# Altium schematic sheet 403.5MHz_LNA.SchDoc
size A4
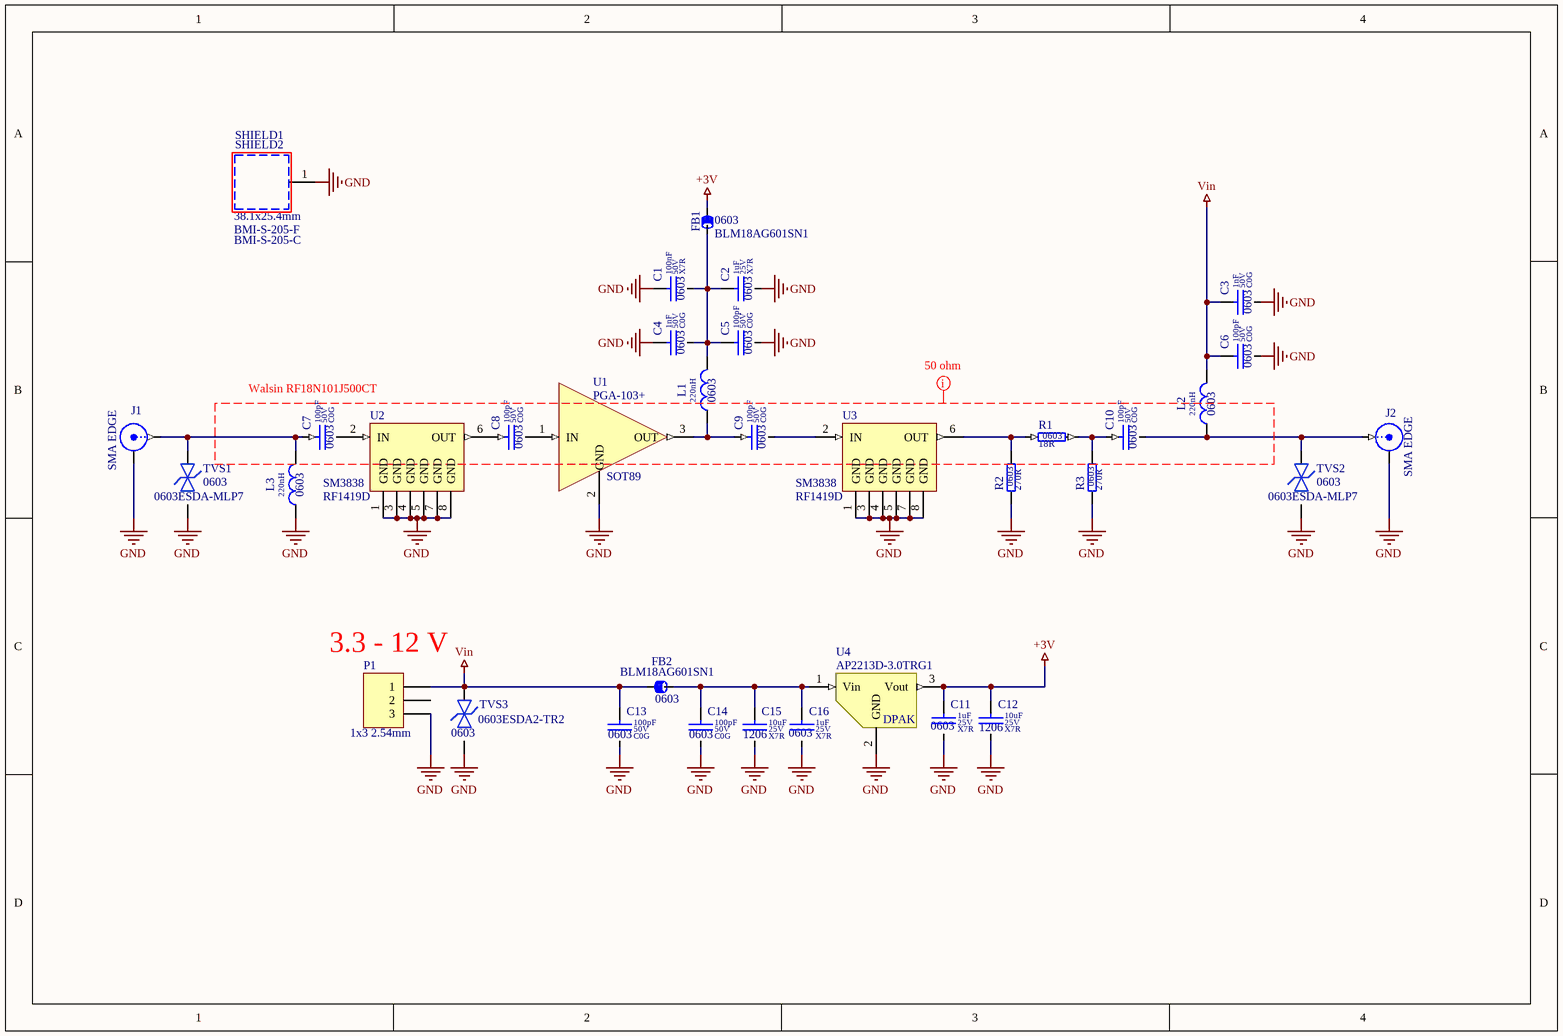
[diagram p0: 403.5MHz_LNA.SchDoc]

## Parts
C1  value 100nF  Dielectric: X7R  Voltage: 50V  SCH_Footprint: 0603  [C_0603_1608]  (hidden comment: Ceramic X7R)
C2  value 1uF  Dielectric: X7R  Voltage: 25V  SCH_Footprint: 0603  [C_0603_1608]  (hidden comment: Ceramic X7R)
C3  value 1nF  Dielectric: C0G  Voltage: 50V  SCH_Footprint: 0603  [C_0603_1608]  (hidden comment: Ceramic C0G)
C4  value 1nF  Dielectric: C0G  Voltage: 50V  SCH_Footprint: 0603  [C_0603_1608]  (hidden comment: Ceramic C0G)
C5  value 100pF  Dielectric: C0G  Voltage: 50V  SCH_Footprint: 0603  [C_0603_1608]  (hidden comment: Ceramic C0G)
C6  value 100pF  Dielectric: C0G  Voltage: 50V  SCH_Footprint: 0603  [C_0603_1608]  (hidden comment: Ceramic C0G)
C7  value 100pF  Dielectric: C0G  Voltage: 50V  SCH_Footprint: 0603  [C_0603_1608]  (hidden comment: Ceramic C0G)
C8  value 100pF  Dielectric: C0G  Voltage: 50V  SCH_Footprint: 0603  [C_0603_1608]  (hidden comment: Ceramic C0G)
C9  value 100pF  Dielectric: C0G  Voltage: 50V  SCH_Footprint: 0603  [C_0603_1608]  (hidden comment: Ceramic C0G)
C10  value 100pF  Dielectric: C0G  Voltage: 50V  SCH_Footprint: 0603  [C_0603_1608]  (hidden comment: Ceramic C0G)
C11  value 1uF  Dielectric: X7R  Voltage: 25V  SCH_Footprint: 0603  [C_0603_1608]  (hidden comment: Ceramic X7R)
C12  value 10uF  Dielectric: X7R  Voltage: 25V  SCH_Footprint: 1206  [C_1206_3216]  (hidden comment: Ceramic X7R)
C13  value 100pF  Dielectric: C0G  Voltage: 50V  SCH_Footprint: 0603  [C_0603_1608]  (hidden comment: Ceramic C0G)
C14  value 100pF  Dielectric: C0G  Voltage: 50V  SCH_Footprint: 0603  [C_0603_1608]  (hidden comment: Ceramic C0G)
C15  value 10uF  Dielectric: X7R  Voltage: 25V  SCH_Footprint: 1206  [C_1206_3216]  (hidden comment: Ceramic X7R)
C16  value 1uF  Dielectric: X7R  Voltage: 25V  SCH_Footprint: 0603  [C_0603_1608]  (hidden comment: Ceramic X7R)
FB1  value BLM18AG601SN1  SCH_Footprint: 0603  [FB_0603_1608]  (hidden comment: Ferrite bead)
FB2  value BLM18AG601SN1  SCH_Footprint: 0603  [FB_0603_1608]  (hidden comment: Ferrite bead)
J1  SMA EDGE  [J_SMA_EDGE_6.25]
J2  SMA EDGE  [J_SMA_EDGE_6.25]
L1  value 220nH  SCH_Footprint: 0603  [L_0603_1608]  (hidden comment: Inductor)
L2  value 220nH  SCH_Footprint: 0603  [L_0603_1608]  (hidden comment: Inductor)
L3  value 220nH  SCH_Footprint: 0603  [L_0603_1608]  (hidden comment: Inductor)
P1  SCH_Footprint: 1x3 2.54mm  [P_HEADER_1x3_2.54]  (hidden comment: Goldpin)
R1  value 18R  SCH_Footprint: 0603  [R_NC_0603_1608]  (hidden comment: Resistor)
R2  value 270R  SCH_Footprint: 0603  [R_NC_0603_1608]  (hidden comment: Resistor)
R3  value 270R  SCH_Footprint: 0603  [R_NC_0603_1608]  (hidden comment: Resistor)
SHIELD1  value BMI-S-205-C  [BMI-S-205-C]  (hidden comment: EMI Shield Cover)
SHIELD2  value BMI-S-205-F  SCH_Footprint: 38.1x25.4mm  [BMI-S-205-F]  (hidden comment: EMI Shield)
TVS1  value 0603ESDA-MLP7  SCH_Footprint: 0603  [R_0603_1608]  (hidden comment: TVS bidirectional)
TVS2  value 0603ESDA-MLP7  SCH_Footprint: 0603  [R_0603_1608]  (hidden comment: TVS bidirectional)
TVS3  value 0603ESDA2-TR2  SCH_Footprint: 0603  [R_0603_1608]  (hidden comment: 0603ESDA2)
U1  value PGA-103+  SCH_Footprint: SOT89  [SOT89_TO-243AA_N]  (hidden comment: PGA103+)
U2  SCH_Footprint: SM3838  [SAW_QCC8B_SM3838-8_3.8x3.8]  (hidden comment: RF1419D)
U3  SCH_Footprint: SM3838  [SAW_QCC8B_SM3838-8_3.8x3.8]  (hidden comment: RF1419D)
U4  value AP2213D-3.0TRG1  SCH_Footprint: DPAK  [DPAK_TO252-3_SC63_M]  (hidden comment: AP2213D-3.0)

## Nets
+3V: C11.1 C12.1 FB1.1 U4.3(Vout)
GND: C1.1 C2.2 C3.2 C4.1 C5.2 C6.2 C11.2 C12.2 C13.2 C14.2 C15.2 C16.2 J1.2(Y) J2.2(Y) L3.1 P1.3 R2.1 R3.1 SHIELD2.1(shield) TVS1.2 TVS2.2 TVS3.2 U1.2(GND) U2.1(GND) U2.3(GND) U2.4(GND) U2.5(GND) U2.7(GND) U2.8(GND) U3.1(GND) U3.3(GND) U3.4(GND) U3.5(GND) U3.7(GND) U3.8(GND) U4.2(GND)
Vin: C3.1 C6.1 C13.1 FB2.1 L2.2 P1.1 TVS3.1
NetC1_2: C1.2 C2.1 C4.2 C5.1 FB1.2 L1.2
NetC7_1: C7.1 J1.1(X) L3.2 TVS1.1
NetC7_2: C7.2 U2.2(IN)
NetC8_1: C8.1 U2.6(OUT)
NetC8_2: C8.2 U1.1(IN)
NetC9_1: C9.1 L1.1 U1.3(OUT)
NetC9_2: C9.2 U3.2(IN)
NetC10_1: C10.1 R1.2 R3.2
NetC10_2: C10.2 J2.1(X) L2.1 TVS2.1
NetC14_1: C14.1 C15.1 C16.1 FB2.2 U4.1(Vin)
NetR1_1: R1.1 R2.2 U3.6(OUT)

Not connected (* = marked no-connect by the designer): P1 2

## Layout directives
net class 50 ohm: (no net found under the mark)

## Notes on the sheet
- Walsin RF18N101J500CT
- 3.3 - 12 V

## Library data of the parts
C1 = C_100nF_50V_X7R_0603_5: Capacitor; Manufacturer: Samsung; Manufacturer Part Number: CL10B104JB8NNNC; Tolerance (%): 5; Part Number: C_100nF_50V_X7R_0603_5; HelpURL: http://www.tme.eu/pl/Document/4a42202b32dab16128fe107dd69598cc/samsung-chip-cap.pdf; Supplier 1: TME; Supplier Part Number 1: CL10B104JB8NNNC; Supplier 2: RS Components; Supplier 3: Farnell; Supplier 4: Mouser; Supplier 5: Digi-Key
C2 C11 C16 = C_1uF_25V_X7R_0603_10: Capacitor; Manufacturer: Samsung; Manufacturer Part Number: CL10B105KA8NNNC; Tolerance (%): 10; Part Number: C_1uF_25V_X7R_0603_10; HelpURL: http://www.tme.eu/pl/Document/4a42202b32dab16128fe107dd69598cc/samsung-chip-cap.pdf; Supplier 1: TME; Supplier Part Number 1: CL10B105KA8NNNC; Supplier 2: RS Components; Supplier 3: Farnell; Supplier 4: Mouser; Supplier 5: Digi-Key
C3 C4 = C_1nF_50V_C0G_0603_5: Capacitor; Manufacturer: Samsung; Manufacturer Part Number: CL10C102JB8NNNC; Tolerance (%): 5; Part Number: C_1nF_50V_C0G_0603_5; HelpURL: http://www.tme.eu/pl/Document/7da762c1dbaf553c64ad9c40d3603826/mlcc_samsung.pdf; Supplier 1: TME; Supplier Part Number 1: CL10C102JB8NNNC; Supplier 2: RS Components; Supplier 3: Farnell; Supplier 4: Mouser; Supplier 5: Digi-Key
C5-C10 C13 C14 = C_100pF_50V_C0G_0603_5: Capacitor; Manufacturer: Walsin; Manufacturer Part Number: RF18N101J500CT; Tolerance (%): 5; Part Number: C_100pF_50V_C0G_0603_5; HelpURL: https://pl.mouser.com/datasheet/2/210/Microwave_Caps-1535561.pdf; Supplier 1: TME; Supplier 2: RS Components; Supplier 3: Farnell; Supplier 4: Mouser; Supplier 5: Digi-Key
C12 C15 = C_10uF_25V_X7R_1206_10: Capacitor; Manufacturer: Samsung Electro-Mechanics; Manufacturer Part Number: CL31B106KAHNNNE; Tolerance (%): 10; Part Number: C_10uF_25V_X7R_1206_10; HelpURL: http://www.tme.eu/pl/Document/4a42202b32dab16128fe107dd69598cc/samsung-chip-cap.pdf; Supplier 1: TME; Supplier Part Number 1: CL31B106KAHNNNE; Supplier 2: RS Components; Supplier 3: Farnell; Supplier 4: Mouser; Supplier 5: Digi-Key
FB1 FB2 = FB_BLM18AG601SN1: Manufacturer: Murata; Manufacturer Part Number: BLM18AG601SN1D; Current: 0A5; Resistance: 600R; Part Number: FB_BLM18AG601SN1; HelpURL: http://datasheet.octopart.com/BLM18AG601SN1D-Murata-datasheet-11743096.pdf; Supplier 1: TME; Supplier 2: RS Components; Supplier Part Number 2: 7241299P; Supplier 3: Farnell; Supplier Part Number 3: 1515679; Supplier 4: Mouser; Supplier Part Number 4: 81-BLM11A601S; Supplier 5: Digi-Key; Supplier Part Number 5: 490-1014-1-ND
J1 J2 = J_SMA_EDGE_6.25: SMA connector; Manufacturer: Adam Tech; Value: RF2-143-T-17-50-G; Part Number: J_SMA_EDGE_6.25; SCH_Footprint: SMA EDGE; Component Type: Standard; HelpURL: http://www.tme.eu/pl/Document/5895dbb620da9c3499391e7670c4adea/RF2-143-T-17-50-G.pdf; Manufacturer Part Number: RF2-143-T-17-50-G; Supplier 1: TME; Supplier Part Number 1: RF2-143-T-17-50-G; Supplier 2: RS Components; Supplier 3: Farnell; Supplier 4: Mouser; Supplier 5: Digi-Key
L1-L3 = L_220nH_120mA_0603: Induction; Manufacturer: Murata; Manufacturer Part Number: LQW18ANR22G00D; Current: 120mA; Resistance: 2.5R; Part Number: L_220nH_120mA_0603; HelpURL: https://datasheet.octopart.com/LQW18ANR22G00D-Murata-datasheet-11553032.pdf; Supplier 1: TME; Supplier Part Number 1: LQW18ANR22G00D; Supplier 2: RS Components; Supplier Part Number 2: 7242872; Supplier 3: Farnell; Supplier Part Number 3: 9528059; Supplier 4: Mouser; Supplier Part Number 4: 81-LQW18ANR22G00D; Supplier 5: Digi-Key; Supplier Part Number 5: 490-6931-1-ND
P1 = P_HEADER_1x3_2.54: Header, 3-Pin; Manufacturer: Connfly; Value: DS1021-1*3SF1-1; Part Number: P_HEADER_1x3_2.54; Component Type: Standard; HelpURL: http://www.tme.eu/en/Document/cc301e58a5da78cb543a94b5a5b7f06a/DS1021.pdf; Manufacturer Part Number: DS1021-1*3SF1-1; Supplier 1: TME; Supplier Part Number 1: ZL201-03G; Supplier 2: RS Components; Supplier 3: Farnell; Supplier 4: Mouser; Supplier 5: Digi-Key
R1-R3 = R_GENERIC_0603: Part Number: R_GENERIC_0603; Supplier 1: TME; Supplier 2: RS Components; Supplier 3: Farnell; Supplier 4: Mouser; Supplier 5: Digi-Key
SHIELD1 = SHIELD_BMI-S-205-C: Shield, 1 pad; Manufacturer: Laird; SCH_Footprint: 38.1x25.4mm; Part Number: SHIELD_BMI-S-205-C; HelpURL: https://assets.lairdtech.com/home/brandworld/files/Board%20Level%20Shields%20Catalog%20Download.pdf; Manufacturer Part Number: BMI-S-205-C; Supplier 1: TME; Supplier 2: RS Components; Supplier 3: Farnell; Supplier Part Number 3: 2497722; Supplier 4: Mouser; Supplier Part Number 4: 739-BMIS-205-C; Supplier 5: Digi-Key; Supplier Part Number 5: 903-1017-ND
SHIELD2 = SHIELD_BMI-S-205-F: Shield, 1 pad; Manufacturer: Laird; Part Number: SHIELD_BMI-S-205-F; HelpURL: https://assets.lairdtech.com/home/brandworld/files/Board%20Level%20Shields%20Catalog%20Download.pdf; Manufacturer Part Number: BMI-S-205-F; Supplier 1: TME; Supplier 2: RS Components; Supplier 3: Farnell; Supplier Part Number 3: 2497723; Supplier 4: Mouser; Supplier Part Number 4: 739-BMIS-205-F; Supplier 5: Digi-Key; Supplier Part Number 5: 903-1054-1-ND
TVS1 TVS2 = TVS_0603ESDA-MLP7: Manufacturer: Bussmann; Voltage: 30V; Part Number: TVS_0603ESDA-MLP7; HelpURL: https://datasheet.octopart.com/0603ESDA-MLP7-Eaton-datasheet-12528739.pdf; Manufacturer Part Number: 0603ESDA-MLP7; Supplier 1: TME; Supplier 2: RS Components; Supplier 3: Farnell; Supplier 4: Mouser; Supplier 5: Digi-Key
TVS3 = TVS_0603ESDA2: Manufacturer: Bussmann; Voltage: 14V; Current: 30A; Part Number: TVS_0603ESDA2; HelpURL: http://www.cooperindustries.com/content/dam/public/bussmann/Electronics/Resources/product-datasheets/bus-elx-ds-4419-0603esda2-tr2.pdf; Manufacturer Part Number: 0603ESDA2-TR2; Supplier 1: TME; Supplier Part Number 1: 0603ESDA2-TR2; Supplier 2: RS Components; Supplier 3: Farnell; Supplier 4: Mouser; Supplier Part Number 4: 504-0603ESDA2-TR2; Supplier 5: Digi-Key; Supplier Part Number 5: 283-4156-1-ND
U1 = U_PGA103+: Manufacturer: Mini-Circuits; Part Number: U_PGA103+; HelpURL: https://ww2.minicircuits.com/pdfs/PGA-103+.pdf; Manufacturer Part Number: PGA-103+; Supplier 1: TME; Supplier 2: RS Components; Supplier 3: Farnell; Supplier 4: Mouser; Supplier 5: Digi-Key
U2 U3 = U_RF1419D: Manufacturer: Murata; Center Frequency (MHz): 403.5; Bandwidth (MHz): 7.5; Max Power (dBm): 10; Manufacturer Part Number: RF1419D; Part Number: U_RF1419D; Value: RF1419D; HelpURL: https://wireless.murata.com/datasheet?/RFM/data/rf1419d.pdf; Supplier 1: TME; Supplier 2: RS Components; Supplier Part Number 2: 9082736; Supplier 3: Farnell; Supplier 4: Mouser; Supplier Part Number 4: 719-RF1419D; Supplier 5: Digi-Key; Supplier Part Number 5: 583-1065-1-ND
U4 = VL_AP2213D-3.0TRG1: Manufacturer: Diodes Inc; Voltage: 3V; Current: 0.5A; Part Number: VL_AP2213D-3.0TRG1; HelpURL: https://pl.mouser.com/datasheet/2/115/AP2213-318105.pdf; Manufacturer Part Number: AP2213D-3.0TRG1; Supplier 1: TME; Supplier 2: RS Components; Supplier 3: Farnell; Supplier 4: Mouser; Supplier Part Number 4: 621-AP2213D-3.0TRG1; Supplier 5: Digi-Key; Supplier Part Number 5: AP2213D-3.0TRG1-ND